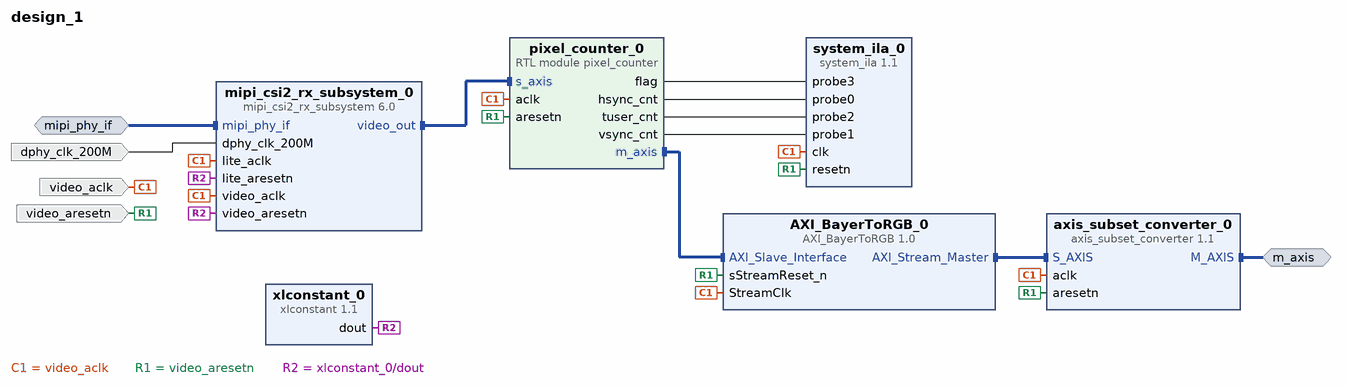
[diagram p0: block diagram of the top level]
# Vivado block design design_1, xc7a35tfgg484-2, Vivado 2025.2
create_bd_design design_1

create_bd_intf_port -mode Master -vlnv xilinx.com:interface:axis_rtl:1.0 m_axis
create_bd_intf_port -mode Slave -vlnv xilinx.com:interface:mipi_phy_rtl:1.0 mipi_phy_if
create_bd_port -dir I -type clk video_aclk
set_property -dict {CONFIG.ASSOCIATED_BUSIF m_axis CONFIG.FREQ_HZ 100000000} [get_bd_ports video_aclk]
create_bd_port -dir I -type clk dphy_clk_200M
set_property -dict {CONFIG.FREQ_HZ 200000000} [get_bd_ports dphy_clk_200M]
create_bd_port -dir I -type rst video_aresetn

create_bd_cell -type ip -vlnv xilinx.com:ip:axis_subset_converter:1.1 axis_subset_converter_0
set_property -dict [list \
  CONFIG.M_HAS_TKEEP 0 \
  CONFIG.M_HAS_TLAST 1 \
  CONFIG.M_HAS_TREADY 1 \
  CONFIG.M_HAS_TSTRB 0 \
  CONFIG.M_TDATA_NUM_BYTES 2 \
  CONFIG.M_TDEST_WIDTH 0 \
  CONFIG.M_TID_WIDTH 0 \
  CONFIG.M_TUSER_WIDTH 1 \
  CONFIG.S_HAS_TKEEP 0 \
  CONFIG.S_HAS_TLAST 1 \
  CONFIG.S_HAS_TREADY 1 \
  CONFIG.S_HAS_TSTRB 0 \
  CONFIG.S_TDEST_WIDTH 0 \
  CONFIG.S_TID_WIDTH 0 \
  CONFIG.S_TUSER_WIDTH 1 \
  CONFIG.TDATA_REMAP {tdata[29:25],tdata[19:14],tdata[9:5]} \
  CONFIG.TLAST_REMAP {tlast[0]} \
  CONFIG.TUSER_REMAP {tuser[0:0]} \
] [get_bd_cells axis_subset_converter_0]
create_bd_cell -type ip -vlnv xilinx.com:ip:mipi_csi2_rx_subsystem:6.0 mipi_csi2_rx_subsystem_0
set_property -dict [list \
  CONFIG.AXIS_TDEST_WIDTH 4 \
  CONFIG.CMN_NUM_LANES 2 \
  CONFIG.CMN_NUM_PIXELS 4 \
  CONFIG.CMN_PXL_FORMAT RAW10 \
  CONFIG.CMN_VC All \
  CONFIG.C_DPHY_LANES 2 \
  CONFIG.C_EXDES_BOARD ZCU102 \
  CONFIG.C_HS_LINE_RATE 1000 \
  CONFIG.C_HS_SETTLE_NS 145 \
  CONFIG.DPY_LINE_RATE 800 \
] [get_bd_cells mipi_csi2_rx_subsystem_0]
create_bd_cell -type ip -vlnv xilinx.com:ip:system_ila:1.1 system_ila_0
set_property -dict [list \
  CONFIG.C_MON_TYPE MIX \
  CONFIG.C_NUM_MONITOR_SLOTS 1 \
  CONFIG.C_NUM_OF_PROBES 4 \
  CONFIG.C_SLOT_0_APC_EN 0 \
  CONFIG.C_SLOT_0_AXI_DATA_SEL 1 \
  CONFIG.C_SLOT_0_AXI_TRIG_SEL 1 \
  CONFIG.C_SLOT_0_INTF_TYPE xilinx.com:interface:axis_rtl:1.0 \
] [get_bd_cells system_ila_0]
create_bd_cell -type ip -vlnv xilinx.com:ip:xlconstant:1.1 xlconstant_0
create_bd_cell -type module -reference pixel_counter pixel_counter_0
create_bd_cell -type ip -vlnv digilentinc.com:user:AXI_BayerToRGB:1.0 AXI_BayerToRGB_0

# ---- connections ----

connect_bd_intf_net [get_bd_intf_pins AXI_BayerToRGB_0/AXI_Stream_Master] [get_bd_intf_pins axis_subset_converter_0/S_AXIS]
connect_bd_intf_net [get_bd_intf_pins axis_subset_converter_0/M_AXIS] [get_bd_intf_ports m_axis]
connect_bd_intf_net [get_bd_intf_pins mipi_csi2_rx_subsystem_0/video_out] [get_bd_intf_pins pixel_counter_0/s_axis]
connect_bd_intf_net [get_bd_intf_pins mipi_csi2_rx_subsystem_0/mipi_phy_if] [get_bd_intf_ports mipi_phy_if]
connect_bd_intf_net [get_bd_intf_pins pixel_counter_0/m_axis] [get_bd_intf_pins AXI_BayerToRGB_0/AXI_Slave_Interface]
connect_bd_net [get_bd_ports dphy_clk_200M] [get_bd_pins mipi_csi2_rx_subsystem_0/dphy_clk_200M]
connect_bd_net [get_bd_pins pixel_counter_0/flag] [get_bd_pins system_ila_0/probe3]
connect_bd_net [get_bd_pins pixel_counter_0/hsync_cnt] [get_bd_pins system_ila_0/probe0]
connect_bd_net [get_bd_pins pixel_counter_0/tuser_cnt] [get_bd_pins system_ila_0/probe2]
connect_bd_net [get_bd_pins pixel_counter_0/vsync_cnt] [get_bd_pins system_ila_0/probe1]
connect_bd_net [get_bd_ports video_aclk] \
  [get_bd_pins pixel_counter_0/aclk] [get_bd_pins axis_subset_converter_0/aclk] \
  [get_bd_pins mipi_csi2_rx_subsystem_0/lite_aclk] [get_bd_pins mipi_csi2_rx_subsystem_0/video_aclk] \
  [get_bd_pins system_ila_0/clk] [get_bd_pins AXI_BayerToRGB_0/StreamClk]
connect_bd_net [get_bd_ports video_aresetn] \
  [get_bd_pins pixel_counter_0/aresetn] [get_bd_pins axis_subset_converter_0/aresetn] [get_bd_pins system_ila_0/resetn] \
  [get_bd_pins AXI_BayerToRGB_0/sStreamReset_n]
connect_bd_net [get_bd_pins xlconstant_0/dout] \
  [get_bd_pins mipi_csi2_rx_subsystem_0/lite_aresetn] [get_bd_pins mipi_csi2_rx_subsystem_0/video_aresetn]

validate_bd_design
save_bd_design
